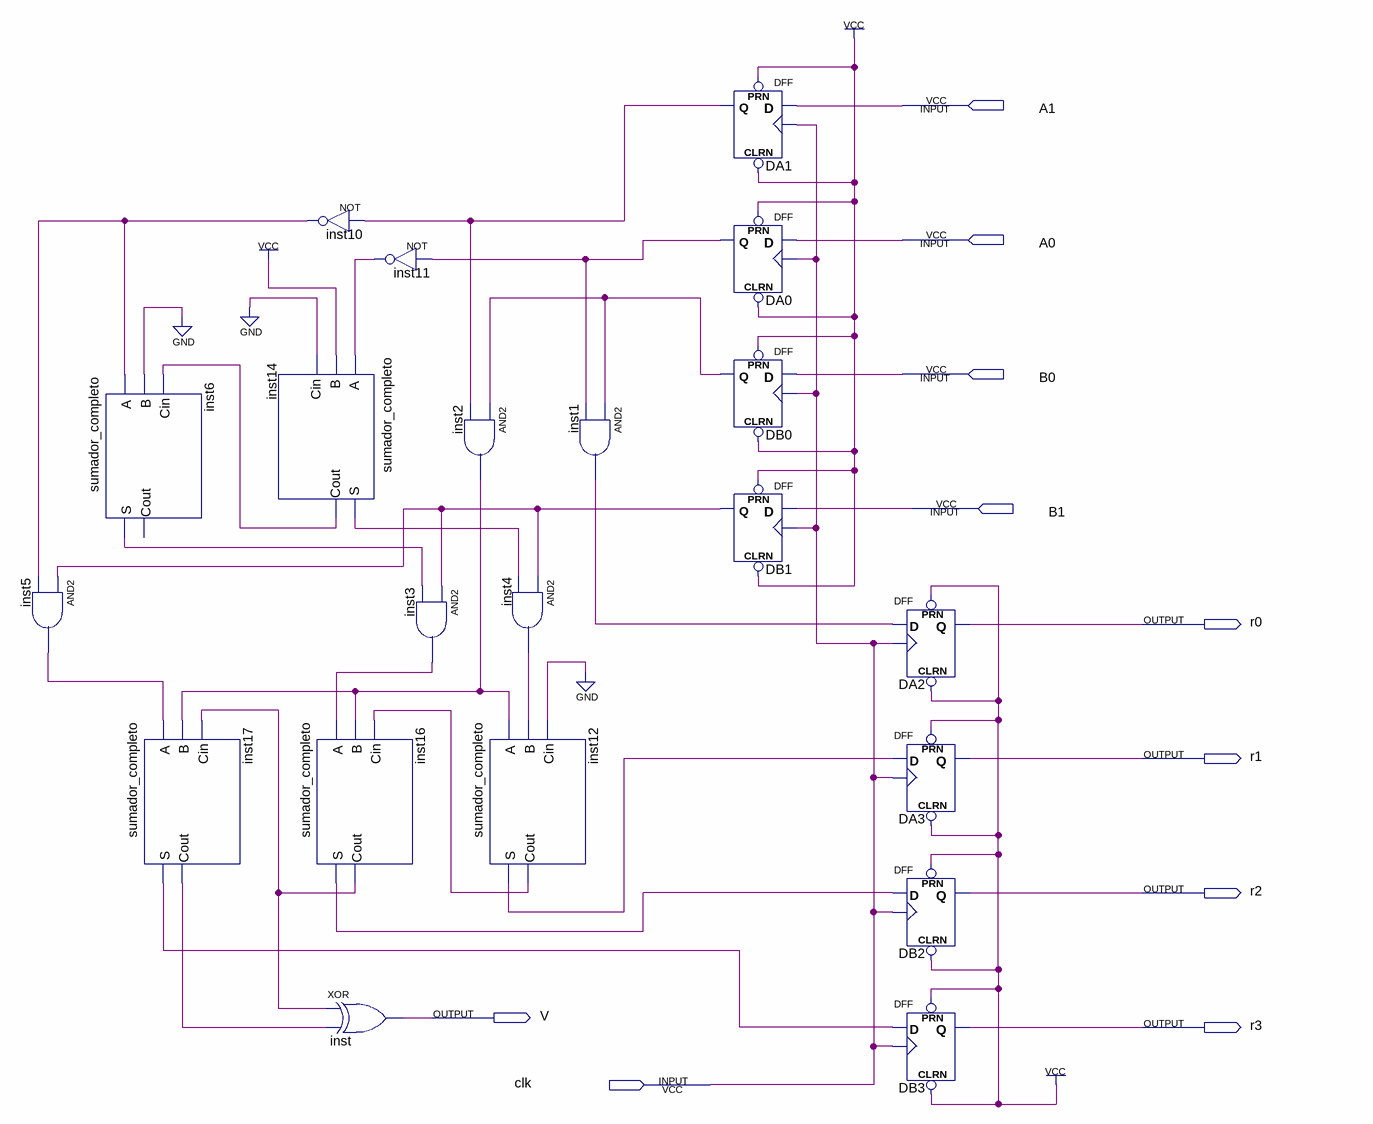
[diagram p0: schematic sheet]
// Quartus schematic mult2x2_Ca2.bdf as structural Verilog: 21 symbols, 10 pins
module mult2x2_Ca2 (
  input  A1,
  input  A0,
  input  B0,
  input  B1,
  input  clk,
  output r0,
  output r1,
  output r2,
  output V,
  output r3
);

  wire DA0_q, DA1_q, DB0_q, DB1_q, inst1_out, inst2_out, inst3_out, inst4_out, inst5_out, inst6_s,
       inst10_out, inst11_out, inst12_cout, inst12_s, inst14_cout, inst14_s, inst16_cout, inst16_s,
       inst17_cout, inst17_s;

  and inst5 (inst5_out, DB1_q, inst10_out);
  sumador_completo inst6 (.A(inst10_out), .B(1'b0), .Cin(inst14_cout), .S(inst6_s));  // open: Cout
  sumador_completo inst17 (.A(inst5_out), .B(inst2_out), .Cin(inst16_cout), .S(inst17_s), .Cout(inst17_cout));
  sumador_completo inst14 (.A(inst11_out), .B(1'b1), .Cin(1'b0), .S(inst14_s), .Cout(inst14_cout));
  not inst10 (inst10_out, DA1_q);
  sumador_completo inst16 (.A(inst3_out), .B(inst2_out), .Cin(inst12_cout), .S(inst16_s), .Cout(inst16_cout));
  xor inst (V, inst16_cout, inst17_cout);
  not inst11 (inst11_out, DA0_q);
  and inst3 (inst3_out, DB1_q, inst6_s);
  and inst2 (inst2_out, DB0_q, DA1_q);
  and inst4 (inst4_out, DB1_q, inst14_s);
  sumador_completo inst12 (.A(inst2_out), .B(inst4_out), .Cin(1'b0), .S(inst12_s), .Cout(inst12_cout));
  and inst1 (inst1_out, DB0_q, DA0_q);
  DFF DA1 (.CLRN(1'b1), .CLK(clk), .D(A1), .PRN(1'b1), .Q(DA1_q));
  DFF DA0 (.CLRN(1'b1), .CLK(clk), .D(A0), .PRN(1'b1), .Q(DA0_q));
  DFF DB0 (.CLRN(1'b1), .CLK(clk), .D(B0), .PRN(1'b1), .Q(DB0_q));
  DFF DB1 (.CLRN(1'b1), .CLK(clk), .D(B1), .PRN(1'b1), .Q(DB1_q));
  DFF DA2 (.CLRN(1'b1), .CLK(clk), .D(inst1_out), .PRN(1'b1), .Q(r0));
  DFF DA3 (.CLRN(1'b1), .CLK(clk), .D(inst12_s), .PRN(1'b1), .Q(r1));
  DFF DB2 (.CLRN(1'b1), .CLK(clk), .D(inst16_s), .PRN(1'b1), .Q(r2));
  DFF DB3 (.CLRN(1'b1), .CLK(clk), .D(inst17_s), .PRN(1'b1), .Q(r3));
endmodule
